# Altium schematic sheet bela_expansion_card_3.SchDoc
size 382 x 191 mm
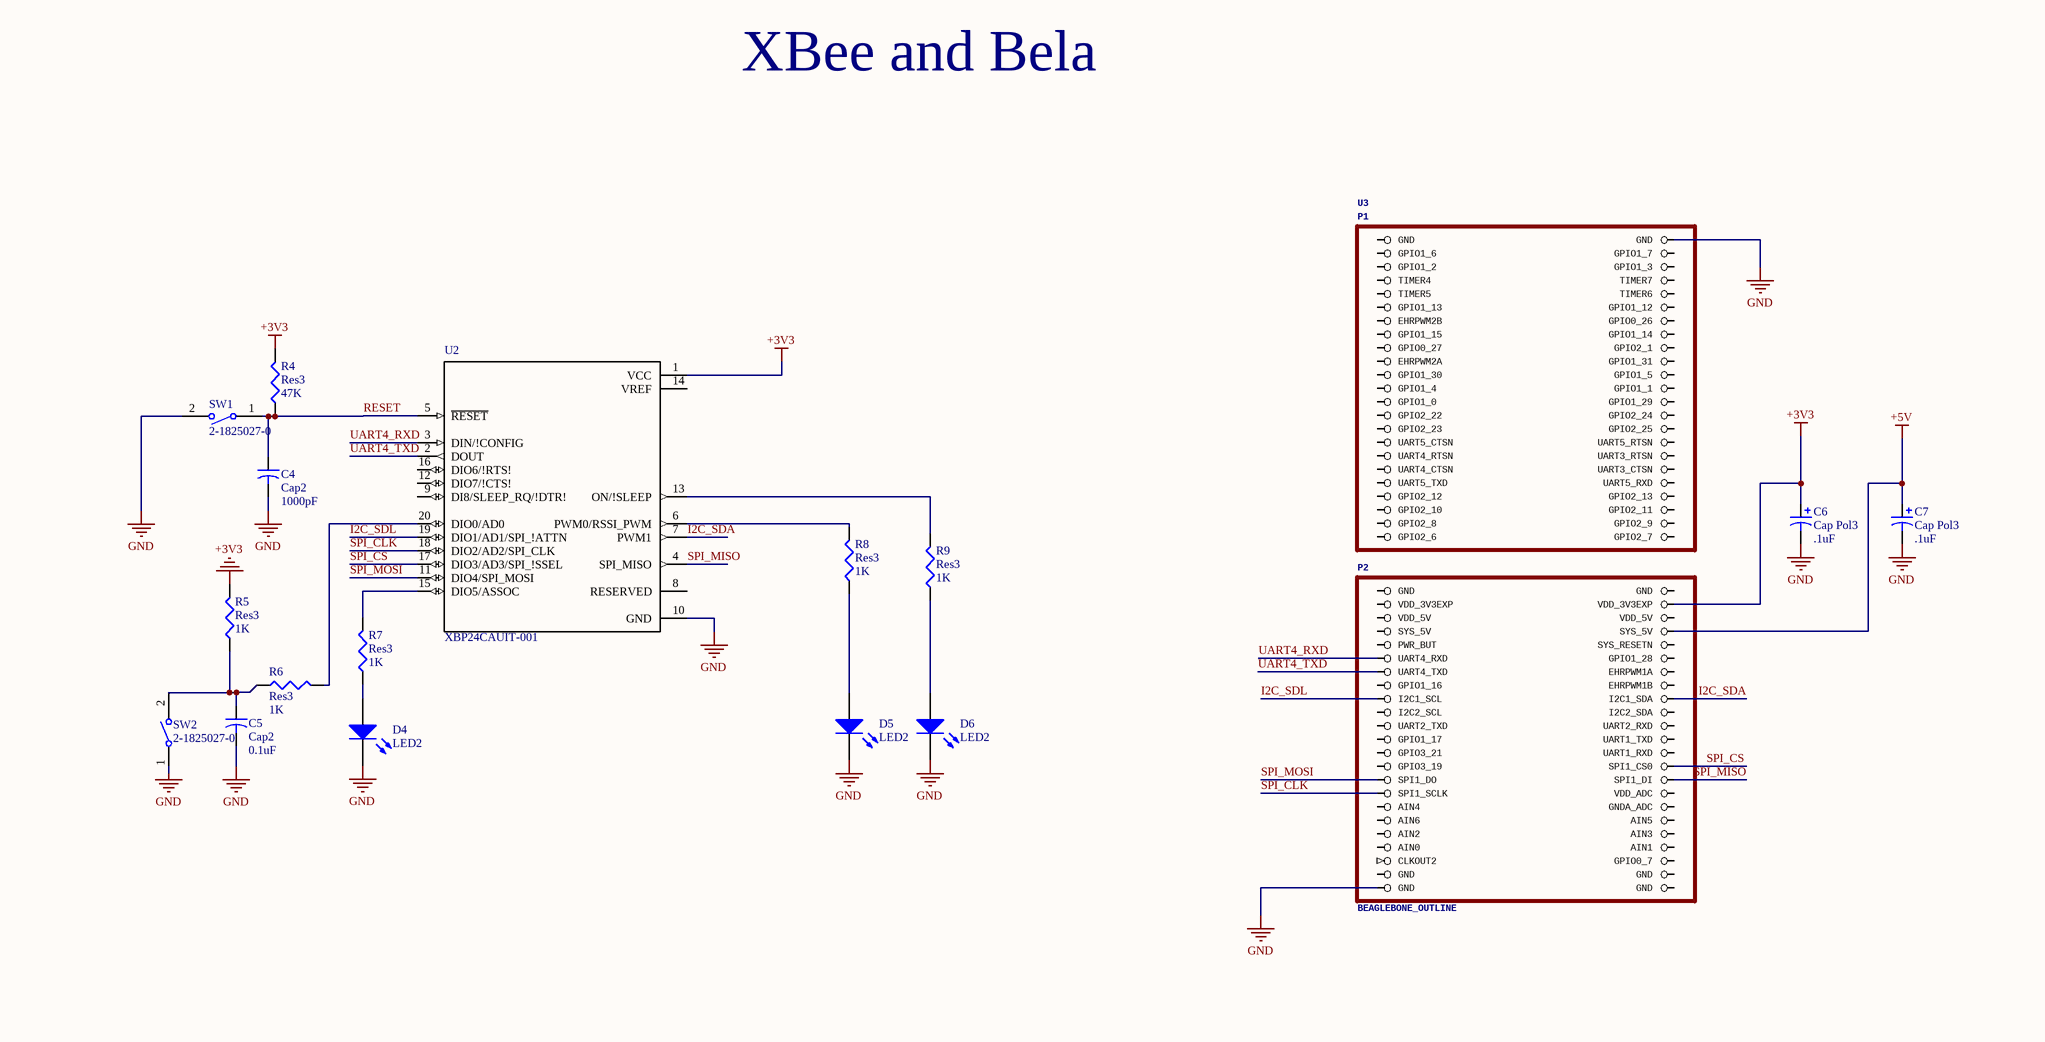
[diagram p0: bela_expansion_card_3.SchDoc]

## Parts
C4  Cap2  value 1000pF  [C0805]
C5  Cap2  value 0.1uF  [C0805]
C6  Cap Pol3  value .1uF  [C0805]
C7  Cap Pol3  value .1uF  [C0805]
D4  LED2  [3.2X1.6X1.1]
D5  LED2  [3.2X1.6X1.1]
D6  LED2  [3.2X1.6X1.1]
R4  Res3  value 47K  [6-0805_L]
R5  Res3  value 1K  [6-0805_L]
R6  Res3  value 1K  [6-0805_L]
R7  Res3  value 1K  [6-0805_L]
R8  Res3  value 1K  [6-0805_L]
R9  Res3  value 1K  [6-0805_L]
SW1  2-1825027-0  [DPST-4]
SW2  2-1825027-0  [DPST-4]
U2  XBP24CAUIT-001  [*MODULE_XBP24CAUIT-001]
U3  BEAGLEBONE_OUTLINE  [BEAGLEBONE_SHIELD]

## Nets
+3V3: C6.1 R4.2 R5.2 U2.1(VCC) U3.50(VDD_3V3EXP)
+5V: C7.1 U3.54(SYS_5V)
GND: C4.2 C5.2 C6.2 C7.2 D4.2(K) D5.2(K) D6.2(K) SW1.2 SW2.1 U2.10(GND) U3.2(GND) U3.91(GND)
I2C_SDA: U2.7(PWM1) U3.64(I2C1_SDA)
I2C_SDL: U2.19(DIO1/AD1/SPI_!ATTN) U3.63(I2C1_SCL)
RESET: C4.1 R4.1 SW1.1 U2.5(~{RESET})
SPI_CLK: U2.18(DIO2/AD2/SPI_CLK) U3.77(SPI1_SCLK)
SPI_CS: U2.17(DIO3/AD3/SPI_!SSEL) U3.74(SPI1_CS0)
SPI_MISO: U2.4(SPI_MISO) U3.76(SPI1_DI)
SPI_MOSI: U2.11(DIO4/SPI_MOSI) U3.75(SPI1_DO)
UART4_RXD: U2.3(DIN/!CONFIG) U3.57(UART4_RXD)
UART4_TXD: U2.2(DOUT) U3.59(UART4_TXD)
NetC5_1: C5.1 R5.1 R6.1 SW2.2
NetD4_1: D4.1(A) R7.1
NetD5_1: D5.1(A) R8.1
NetD6_1: D6.1(A) R9.1
NetR6_2: R6.2 U2.20(DIO0/AD0)
NetR7_2: R7.2 U2.15(DIO5/ASSOC)
NetR8_2: R8.2 U2.6(PWM0/RSSI_PWM)
NetR9_2: R9.2 U2.13(ON/!SLEEP)

Not connected (* = marked no-connect by the designer): U2 8(RESERVED) 9(DI8/SLEEP_RQ/!DTR!) 12(DIO7/!CTS!) 14(VREF) 16(DIO6/!RTS!); U3 1(GND) 3(GPIO1_6) 4(GPIO1_7) 5(GPIO1_2) 6(GPIO1_3) 7(TIMER4) 8(TIMER7) 9(TIMER5) 10(TIMER6) 11(GPIO1_13) 12(GPIO1_12) 13(EHRPWM2B) 14(GPIO0_26) 15(GPIO1_15) 16(GPIO1_14) 17(GPIO0_27) 18(GPIO2_1) 19(EHRPWM2A) 20(GPIO1_31) 21(GPIO1_30) 22(GPIO1_5) 23(GPIO1_4) 24(GPIO1_1) 25(GPIO1_0) 26(GPIO1_29) 27(GPIO2_22) 28(GPIO2_24) 29(GPIO2_23) 30(GPIO2_25) 31(UART5_CTSN) 32(UART5_RTSN) 33(UART4_RTSN) 34(UART3_RTSN) 35(UART4_CTSN) 36(UART3_CTSN) 37(UART5_TXD) 38(UART5_RXD) 39(GPIO2_12) 40(GPIO2_13) 41(GPIO2_10) 42(GPIO2_11) 43(GPIO2_8) 44(GPIO2_9) 45(GPIO2_6) 46(GPIO2_7) 47(GND) 48(GND) 49(VDD_3V3EXP) 51(VDD_5V) 52(VDD_5V) 53(SYS_5V) 55(PWR_BUT) 56(SYS_RESETN) 58(GPIO1_28) 60(EHRPWM1A) 61(GPIO1_16) 62(EHRPWM1B) 65(I2C2_SCL) 66(I2C2_SDA) 67(UART2_TXD) 68(UART2_RXD) 69(GPIO1_17) 70(UART1_TXD) 71(GPIO3_21) 72(UART1_RXD) 73(GPIO3_19) 78(VDD_ADC) 79(AIN4) 80(GNDA_ADC) 81(AIN6) 82(AIN5) 83(AIN2) 84(AIN3) 85(AIN0) 86(AIN1) 87(CLKOUT2) 88(GPIO0_7) 89(GND) 90(GND) 92(GND)

## Notes on the sheet
- XBee and Bela

## Library data of the parts
C4 = Cap2_4: Capacitor; Published: 23-Sep-2002; PackageReference: CAPR5-4X5; Publisher: Altium Limited; PackageDescription: Capacitor; 2 Leads
C5 = Cap2_1: Capacitor; Published: 23-Sep-2002; PackageReference: CAPR5-4X5; Publisher: Altium Limited; PackageDescription: Capacitor; 2 Leads
C6 C7 = Cap Pol3: Polarized Capacitor (Surface Mount); Published: 8-Jun-2000; LatestRevisionDate: 29-May-2009; LatestRevisionNote: IPC-7351 Footprint Added.; PackageReference: C0805; Publisher: Altium Limited; PackageDescription: Chip Capacitor
D4-D6 = LED2: Typical RED, GREEN, YELLOW, AMBER GaAs LED; Published: 8-Jun-2000; LatestRevisionDate: 17-Jul-2002; LatestRevisionNote: Re-released for DXP Platform.; PackageVersion: Feb-2002; PackageReference: 3.2X1.6X1.1; Publisher: Altium Limited; PackageDescription: SM LED; 2 Flat Leads
R4-R9 = Res3: Resistor; Published: 8-Jun-2000; LatestRevisionDate: 29-May-2009; LatestRevisionNote: IPC-7351 Footprint Added.; PackageReference: J1-0603; Publisher: Altium Limited; PackageDescription: Chip Resistor
SW1 SW2 = CMP-2000-05529-1: Micro-Miniature Pushbutton Switch, 50 mA, -35 to 85 degC, 2-Pin THD, RoHS, Bulk; Manufacturer: TE Connectivity; Pole Throw Configuration: SPST; Body Orientation: RightAngle; Product Length (mm): 7.11mm; Voltage Rating (VDC): 24V; Current Rating (Max): 0.05A; Product Depth (mm): 10mm; Operating Force: 1.57N; Actuator Style: RoundButton; Illumination Type: NotRequired; Ground Terminal: No; Product Height (mm): 7.01mm; Actuator Color: Black; Switch Function Configuration: OFFON; Package Reference: 2-1825027-0; Terminal Type: PCPins; Contact Plating: Silver; Package Description: 2-Pin Through Hole Device, Body 15.86 x 7.11 mm, Pitch 4.5 mm; Mounting Style: ThroughHole; Manufacturer URL: http://www.te.com/; Datasheet URL: http://www.te.com/commerce/DocumentDelivery/DDEController?Action=showdoc&DocId=Customer+Drawing%7F1825027%7FG4%7Fpdf%7FEnglish%7FENG_CD_1825027_G4.pdf%7F2-1825027-0; Operating Temp Range: -35Cto85C; Packaging: TapeandReel; Datasheet Version: Rev. G4, 06/2011; Mounting Technology: ThroughHole; Contact Material: CopperAlloy; Type: Micro-Miniature; Manufacturer 1: TE Connectivity; Manufacturer Part Number 1: 2-1825027-0
U2 = XBP24CAUIT-001: 802.15.4 Transceiver Module 2.4GHz Antenna Not Included, U.FL Through Hole; MF: Digi International; Package: Module Digi International; MP: XBP24CAUIT-001; SnapEDA_Link: https://www.snapeda.com/parts/XBP24CAUIT-001/Digi%20International/view-part/1219456/?ref=snap; Availability: Unavailable; Price: None; Value: *
U3 = BEAGLEBONE_OUTLINE: Should match A3 pinout - but not completely tested; GateName_1: G$1; SymbolName_1: BEAGLEBONE-1; LibraryName: adafruit; DeviceSetName: BEAGLEBONE_OUTLINE; P1: P1; P2: P2